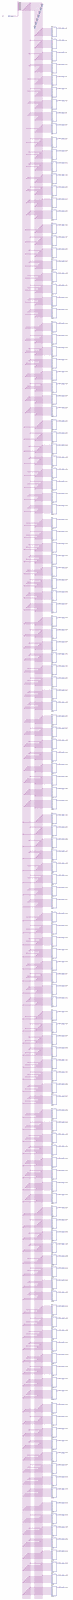
[diagram p0: schematic sheet, whole]
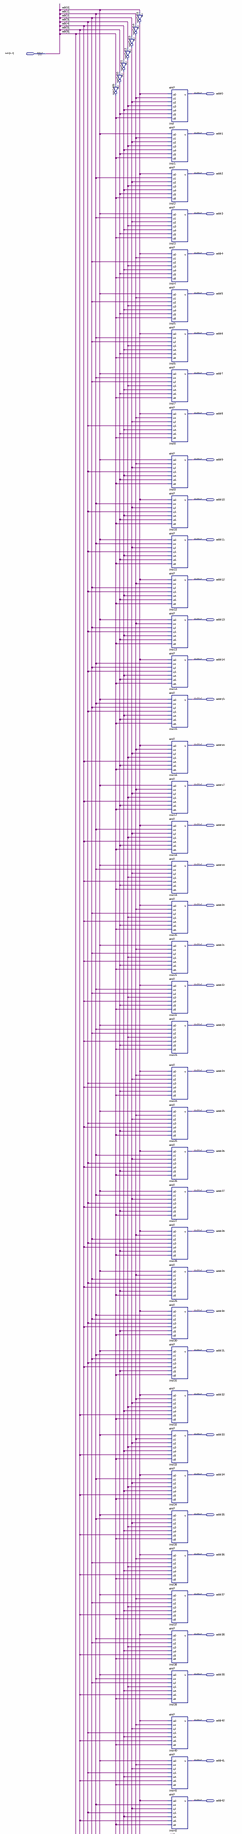
[diagram p1: schematic sheet, upper part]
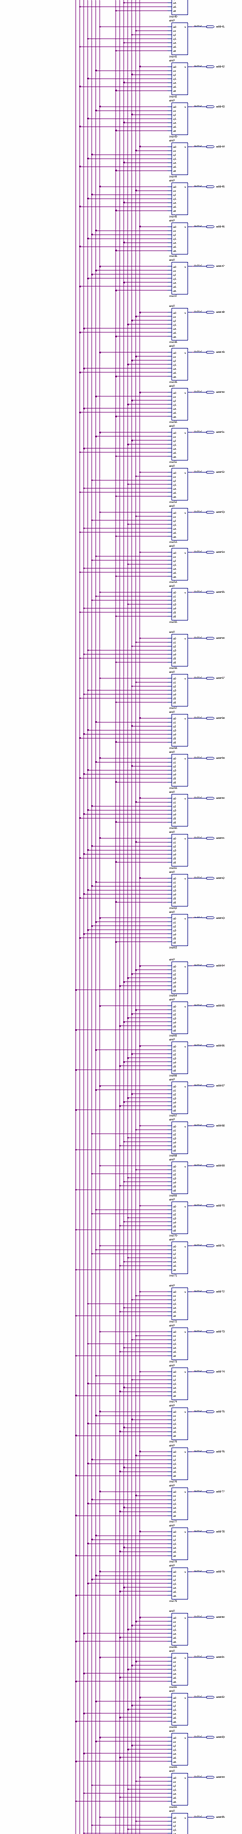
[diagram p2: schematic sheet, middle part]
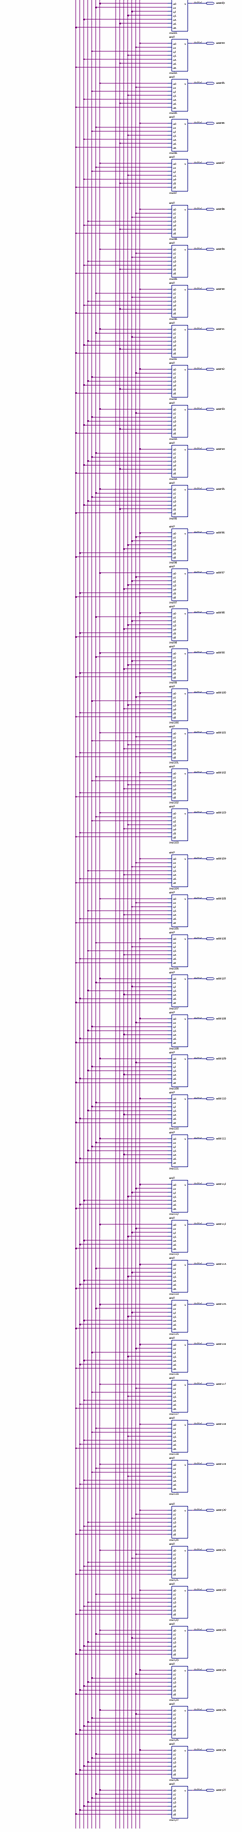
[diagram p3: schematic sheet, lower part]
// Quartus schematic ymq_7.bdf as structural Verilog: 135 symbols, 129 pins
module ymq_7 (
  input  [6:0] adr,
  output addr0,
  output addr1,
  output addr2,
  output addr3,
  output addr4,
  output addr5,
  output addr6,
  output addr7,
  output addr8,
  output addr9,
  output addr10,
  output addr11,
  output addr12,
  output addr13,
  output addr14,
  output addr15,
  output addr16,
  output addr17,
  output addr18,
  output addr19,
  output addr20,
  output addr21,
  output addr22,
  output addr23,
  output addr24,
  output addr25,
  output addr26,
  output addr27,
  output addr28,
  output addr29,
  output addr30,
  output addr31,
  output addr32,
  output addr33,
  output addr34,
  output addr35,
  output addr36,
  output addr37,
  output addr38,
  output addr39,
  output addr40,
  output addr41,
  output addr42,
  output addr43,
  output addr44,
  output addr45,
  output addr46,
  output addr47,
  output addr48,
  output addr49,
  output addr50,
  output addr51,
  output addr52,
  output addr53,
  output addr54,
  output addr55,
  output addr56,
  output addr57,
  output addr58,
  output addr59,
  output addr60,
  output addr61,
  output addr62,
  output addr63,
  output addr64,
  output addr65,
  output addr66,
  output addr67,
  output addr68,
  output addr69,
  output addr70,
  output addr71,
  output addr72,
  output addr73,
  output addr74,
  output addr75,
  output addr76,
  output addr77,
  output addr78,
  output addr79,
  output addr80,
  output addr81,
  output addr82,
  output addr83,
  output addr84,
  output addr85,
  output addr86,
  output addr87,
  output addr88,
  output addr89,
  output addr90,
  output addr91,
  output addr92,
  output addr93,
  output addr94,
  output addr95,
  output addr96,
  output addr97,
  output addr98,
  output addr99,
  output addr100,
  output addr101,
  output addr102,
  output addr103,
  output addr104,
  output addr105,
  output addr106,
  output addr107,
  output addr108,
  output addr109,
  output addr110,
  output addr111,
  output addr112,
  output addr113,
  output addr114,
  output addr115,
  output addr116,
  output addr117,
  output addr118,
  output addr119,
  output addr120,
  output addr121,
  output addr122,
  output addr123,
  output addr124,
  output addr125,
  output addr126,
  output addr127
);

  wire inst1409_out, inst1410_out, inst1411_out, inst1412_out, inst1413_out, inst1414_out, inst1415_out;

  not inst1410 (inst1410_out, adr[5]);
  not inst1409 (inst1409_out, adr[6]);
  not inst1414 (inst1414_out, adr[1]);
  not inst1413 (inst1413_out, adr[2]);
  not inst1412 (inst1412_out, adr[3]);
  not inst1411 (inst1411_out, adr[4]);
  not inst1415 (inst1415_out, adr[0]);
  and7 inst (
    .u0(inst1415_out), .u1(inst1414_out), .u2(inst1413_out), .u3(inst1412_out), .u4(inst1411_out),
    .u5(inst1410_out), .u6(inst1409_out), .v(addr0));
  and7 inst1 (
    .u0(adr[0]), .u1(inst1414_out), .u2(inst1413_out), .u3(inst1412_out), .u4(inst1411_out),
    .u5(inst1410_out), .u6(inst1409_out), .v(addr1));
  and7 inst2 (
    .u0(inst1415_out), .u1(adr[1]), .u2(inst1413_out), .u3(inst1412_out), .u4(inst1411_out),
    .u5(inst1410_out), .u6(inst1409_out), .v(addr2));
  and7 inst3 (
    .u0(adr[0]), .u1(adr[1]), .u2(inst1413_out), .u3(inst1412_out), .u4(inst1411_out), .u5(inst1410_out),
    .u6(inst1409_out), .v(addr3));
  and7 inst4 (
    .u0(inst1415_out), .u1(inst1414_out), .u2(adr[2]), .u3(inst1412_out), .u4(inst1411_out),
    .u5(inst1410_out), .u6(inst1409_out), .v(addr4));
  and7 inst5 (
    .u0(adr[0]), .u1(inst1414_out), .u2(adr[2]), .u3(inst1412_out), .u4(inst1411_out), .u5(inst1410_out),
    .u6(inst1409_out), .v(addr5));
  and7 inst6 (
    .u0(inst1415_out), .u1(adr[1]), .u2(adr[2]), .u3(inst1412_out), .u4(inst1411_out), .u5(inst1410_out),
    .u6(inst1409_out), .v(addr6));
  and7 inst7 (
    .u0(adr[0]), .u1(adr[1]), .u2(adr[2]), .u3(inst1412_out), .u4(inst1411_out), .u5(inst1410_out),
    .u6(inst1409_out), .v(addr7));
  and7 inst8 (
    .u0(inst1415_out), .u1(inst1414_out), .u2(inst1413_out), .u3(adr[3]), .u4(inst1411_out),
    .u5(inst1410_out), .u6(inst1409_out), .v(addr8));
  and7 inst9 (
    .u0(adr[0]), .u1(inst1414_out), .u2(inst1413_out), .u3(adr[3]), .u4(inst1411_out), .u5(inst1410_out),
    .u6(inst1409_out), .v(addr9));
  and7 inst10 (
    .u0(inst1415_out), .u1(adr[1]), .u2(inst1413_out), .u3(adr[3]), .u4(inst1411_out), .u5(inst1410_out),
    .u6(inst1409_out), .v(addr10));
  and7 inst11 (
    .u0(adr[0]), .u1(adr[1]), .u2(inst1413_out), .u3(adr[3]), .u4(inst1411_out), .u5(inst1410_out),
    .u6(inst1409_out), .v(addr11));
  and7 inst12 (
    .u0(inst1415_out), .u1(inst1414_out), .u2(adr[2]), .u3(adr[3]), .u4(inst1411_out), .u5(inst1410_out),
    .u6(inst1409_out), .v(addr12));
  and7 inst13 (
    .u0(adr[0]), .u1(inst1414_out), .u2(adr[2]), .u3(adr[3]), .u4(inst1411_out), .u5(inst1410_out),
    .u6(inst1409_out), .v(addr13));
  and7 inst14 (
    .u0(inst1415_out), .u1(adr[1]), .u2(adr[2]), .u3(adr[3]), .u4(inst1411_out), .u5(inst1410_out),
    .u6(inst1409_out), .v(addr14));
  and7 inst15 (
    .u0(adr[0]), .u1(adr[1]), .u2(adr[2]), .u3(adr[3]), .u4(inst1411_out), .u5(inst1410_out),
    .u6(inst1409_out), .v(addr15));
  and7 inst16 (
    .u0(inst1415_out), .u1(inst1414_out), .u2(inst1413_out), .u3(inst1412_out), .u4(adr[4]),
    .u5(inst1410_out), .u6(inst1409_out), .v(addr16));
  and7 inst17 (
    .u0(adr[0]), .u1(inst1414_out), .u2(inst1413_out), .u3(inst1412_out), .u4(adr[4]), .u5(inst1410_out),
    .u6(inst1409_out), .v(addr17));
  and7 inst18 (
    .u0(inst1415_out), .u1(adr[1]), .u2(inst1413_out), .u3(inst1412_out), .u4(adr[4]), .u5(inst1410_out),
    .u6(inst1409_out), .v(addr18));
  and7 inst19 (
    .u0(adr[0]), .u1(adr[1]), .u2(inst1413_out), .u3(inst1412_out), .u4(adr[4]), .u5(inst1410_out),
    .u6(inst1409_out), .v(addr19));
  and7 inst20 (
    .u0(inst1415_out), .u1(inst1414_out), .u2(adr[2]), .u3(inst1412_out), .u4(adr[4]), .u5(inst1410_out),
    .u6(inst1409_out), .v(addr20));
  and7 inst21 (
    .u0(adr[0]), .u1(inst1414_out), .u2(adr[2]), .u3(inst1412_out), .u4(adr[4]), .u5(inst1410_out),
    .u6(inst1409_out), .v(addr21));
  and7 inst22 (
    .u0(inst1415_out), .u1(adr[1]), .u2(adr[2]), .u3(inst1412_out), .u4(adr[4]), .u5(inst1410_out),
    .u6(inst1409_out), .v(addr22));
  and7 inst23 (
    .u0(adr[0]), .u1(adr[1]), .u2(adr[2]), .u3(inst1412_out), .u4(adr[4]), .u5(inst1410_out),
    .u6(inst1409_out), .v(addr23));
  and7 inst24 (
    .u0(inst1415_out), .u1(inst1414_out), .u2(inst1413_out), .u3(adr[3]), .u4(adr[4]), .u5(inst1410_out),
    .u6(inst1409_out), .v(addr24));
  and7 inst25 (
    .u0(adr[0]), .u1(inst1414_out), .u2(inst1413_out), .u3(adr[3]), .u4(adr[4]), .u5(inst1410_out),
    .u6(inst1409_out), .v(addr25));
  and7 inst26 (
    .u0(inst1415_out), .u1(adr[1]), .u2(inst1413_out), .u3(adr[3]), .u4(adr[4]), .u5(inst1410_out),
    .u6(inst1409_out), .v(addr26));
  and7 inst27 (
    .u0(adr[0]), .u1(adr[1]), .u2(inst1413_out), .u3(adr[3]), .u4(adr[4]), .u5(inst1410_out),
    .u6(inst1409_out), .v(addr27));
  and7 inst28 (
    .u0(inst1415_out), .u1(inst1414_out), .u2(adr[2]), .u3(adr[3]), .u4(adr[4]), .u5(inst1410_out),
    .u6(inst1409_out), .v(addr28));
  and7 inst29 (
    .u0(adr[0]), .u1(inst1414_out), .u2(adr[2]), .u3(adr[3]), .u4(adr[4]), .u5(inst1410_out),
    .u6(inst1409_out), .v(addr29));
  and7 inst30 (
    .u0(inst1415_out), .u1(adr[1]), .u2(adr[2]), .u3(adr[3]), .u4(adr[4]), .u5(inst1410_out),
    .u6(inst1409_out), .v(addr30));
  and7 inst31 (
    .u0(adr[0]), .u1(adr[1]), .u2(adr[2]), .u3(adr[3]), .u4(adr[4]), .u5(inst1410_out), .u6(inst1409_out),
    .v(addr31));
  and7 inst32 (
    .u0(inst1415_out), .u1(inst1414_out), .u2(inst1413_out), .u3(inst1412_out), .u4(inst1411_out),
    .u5(adr[5]), .u6(inst1409_out), .v(addr32));
  and7 inst33 (
    .u0(adr[0]), .u1(inst1414_out), .u2(inst1413_out), .u3(inst1412_out), .u4(inst1411_out), .u5(adr[5]),
    .u6(inst1409_out), .v(addr33));
  and7 inst34 (
    .u0(inst1415_out), .u1(adr[1]), .u2(inst1413_out), .u3(inst1412_out), .u4(inst1411_out), .u5(adr[5]),
    .u6(inst1409_out), .v(addr34));
  and7 inst35 (
    .u0(adr[0]), .u1(adr[1]), .u2(inst1413_out), .u3(inst1412_out), .u4(inst1411_out), .u5(adr[5]),
    .u6(inst1409_out), .v(addr35));
  and7 inst36 (
    .u0(inst1415_out), .u1(inst1414_out), .u2(adr[2]), .u3(inst1412_out), .u4(inst1411_out), .u5(adr[5]),
    .u6(inst1409_out), .v(addr36));
  and7 inst37 (
    .u0(adr[0]), .u1(inst1414_out), .u2(adr[2]), .u3(inst1412_out), .u4(inst1411_out), .u5(adr[5]),
    .u6(inst1409_out), .v(addr37));
  and7 inst38 (
    .u0(inst1415_out), .u1(adr[1]), .u2(adr[2]), .u3(inst1412_out), .u4(inst1411_out), .u5(adr[5]),
    .u6(inst1409_out), .v(addr38));
  and7 inst39 (
    .u0(adr[0]), .u1(adr[1]), .u2(adr[2]), .u3(inst1412_out), .u4(inst1411_out), .u5(adr[5]),
    .u6(inst1409_out), .v(addr39));
  and7 inst40 (
    .u0(inst1415_out), .u1(inst1414_out), .u2(inst1413_out), .u3(adr[3]), .u4(inst1411_out), .u5(adr[5]),
    .u6(inst1409_out), .v(addr40));
  and7 inst41 (
    .u0(adr[0]), .u1(inst1414_out), .u2(inst1413_out), .u3(adr[3]), .u4(inst1411_out), .u5(adr[5]),
    .u6(inst1409_out), .v(addr41));
  and7 inst42 (
    .u0(inst1415_out), .u1(adr[1]), .u2(inst1413_out), .u3(adr[3]), .u4(inst1411_out), .u5(adr[5]),
    .u6(inst1409_out), .v(addr42));
  and7 inst43 (
    .u0(adr[0]), .u1(adr[1]), .u2(inst1413_out), .u3(adr[3]), .u4(inst1411_out), .u5(adr[5]),
    .u6(inst1409_out), .v(addr43));
  and7 inst44 (
    .u0(inst1415_out), .u1(inst1414_out), .u2(adr[2]), .u3(adr[3]), .u4(inst1411_out), .u5(adr[5]),
    .u6(inst1409_out), .v(addr44));
  and7 inst45 (
    .u0(adr[0]), .u1(inst1414_out), .u2(adr[2]), .u3(adr[3]), .u4(inst1411_out), .u5(adr[5]),
    .u6(inst1409_out), .v(addr45));
  and7 inst46 (
    .u0(inst1415_out), .u1(adr[1]), .u2(adr[2]), .u3(adr[3]), .u4(inst1411_out), .u5(adr[5]),
    .u6(inst1409_out), .v(addr46));
  and7 inst47 (
    .u0(adr[0]), .u1(adr[1]), .u2(adr[2]), .u3(adr[3]), .u4(inst1411_out), .u5(adr[5]), .u6(inst1409_out),
    .v(addr47));
  and7 inst48 (
    .u0(inst1415_out), .u1(inst1414_out), .u2(inst1413_out), .u3(inst1412_out), .u4(adr[4]), .u5(adr[5]),
    .u6(inst1409_out), .v(addr48));
  and7 inst49 (
    .u0(adr[0]), .u1(inst1414_out), .u2(inst1413_out), .u3(inst1412_out), .u4(adr[4]), .u5(adr[5]),
    .u6(inst1409_out), .v(addr49));
  and7 inst50 (
    .u0(inst1415_out), .u1(adr[1]), .u2(inst1413_out), .u3(inst1412_out), .u4(adr[4]), .u5(adr[5]),
    .u6(inst1409_out), .v(addr50));
  and7 inst51 (
    .u0(adr[0]), .u1(adr[1]), .u2(inst1413_out), .u3(inst1412_out), .u4(adr[4]), .u5(adr[5]),
    .u6(inst1409_out), .v(addr51));
  and7 inst52 (
    .u0(inst1415_out), .u1(inst1414_out), .u2(adr[2]), .u3(inst1412_out), .u4(adr[4]), .u5(adr[5]),
    .u6(inst1409_out), .v(addr52));
  and7 inst53 (
    .u0(adr[0]), .u1(inst1414_out), .u2(adr[2]), .u3(inst1412_out), .u4(adr[4]), .u5(adr[5]),
    .u6(inst1409_out), .v(addr53));
  and7 inst54 (
    .u0(inst1415_out), .u1(adr[1]), .u2(adr[2]), .u3(inst1412_out), .u4(adr[4]), .u5(adr[5]),
    .u6(inst1409_out), .v(addr54));
  and7 inst55 (
    .u0(adr[0]), .u1(adr[1]), .u2(adr[2]), .u3(inst1412_out), .u4(adr[4]), .u5(adr[5]), .u6(inst1409_out),
    .v(addr55));
  and7 inst56 (
    .u0(inst1415_out), .u1(inst1414_out), .u2(inst1413_out), .u3(adr[3]), .u4(adr[4]), .u5(adr[5]),
    .u6(inst1409_out), .v(addr56));
  and7 inst57 (
    .u0(adr[0]), .u1(inst1414_out), .u2(inst1413_out), .u3(adr[3]), .u4(adr[4]), .u5(adr[5]),
    .u6(inst1409_out), .v(addr57));
  and7 inst58 (
    .u0(inst1415_out), .u1(adr[1]), .u2(inst1413_out), .u3(adr[3]), .u4(adr[4]), .u5(adr[5]),
    .u6(inst1409_out), .v(addr58));
  and7 inst59 (
    .u0(adr[0]), .u1(adr[1]), .u2(inst1413_out), .u3(adr[3]), .u4(adr[4]), .u5(adr[5]), .u6(inst1409_out),
    .v(addr59));
  and7 inst60 (
    .u0(inst1415_out), .u1(inst1414_out), .u2(adr[2]), .u3(adr[3]), .u4(adr[4]), .u5(adr[5]),
    .u6(inst1409_out), .v(addr60));
  and7 inst61 (
    .u0(adr[0]), .u1(inst1414_out), .u2(adr[2]), .u3(adr[3]), .u4(adr[4]), .u5(adr[5]), .u6(inst1409_out),
    .v(addr61));
  and7 inst62 (
    .u0(inst1415_out), .u1(adr[1]), .u2(adr[2]), .u3(adr[3]), .u4(adr[4]), .u5(adr[5]), .u6(inst1409_out),
    .v(addr62));
  and7 inst63 (
    .u0(adr[0]), .u1(adr[1]), .u2(adr[2]), .u3(adr[3]), .u4(adr[4]), .u5(adr[5]), .u6(inst1409_out),
    .v(addr63));
  and7 inst64 (
    .u0(inst1415_out), .u1(inst1414_out), .u2(inst1413_out), .u3(inst1412_out), .u4(inst1411_out),
    .u5(inst1410_out), .u6(adr[6]), .v(addr64));
  and7 inst65 (
    .u0(adr[0]), .u1(inst1414_out), .u2(inst1413_out), .u3(inst1412_out), .u4(inst1411_out),
    .u5(inst1410_out), .u6(adr[6]), .v(addr65));
  and7 inst66 (
    .u0(inst1415_out), .u1(adr[1]), .u2(inst1413_out), .u3(inst1412_out), .u4(inst1411_out),
    .u5(inst1410_out), .u6(adr[6]), .v(addr66));
  and7 inst67 (
    .u0(adr[0]), .u1(adr[1]), .u2(inst1413_out), .u3(inst1412_out), .u4(inst1411_out), .u5(inst1410_out),
    .u6(adr[6]), .v(addr67));
  and7 inst68 (
    .u0(inst1415_out), .u1(inst1414_out), .u2(adr[2]), .u3(inst1412_out), .u4(inst1411_out),
    .u5(inst1410_out), .u6(adr[6]), .v(addr68));
  and7 inst69 (
    .u0(adr[0]), .u1(inst1414_out), .u2(adr[2]), .u3(inst1412_out), .u4(inst1411_out), .u5(inst1410_out),
    .u6(adr[6]), .v(addr69));
  and7 inst70 (
    .u0(inst1415_out), .u1(adr[1]), .u2(adr[2]), .u3(inst1412_out), .u4(inst1411_out), .u5(inst1410_out),
    .u6(adr[6]), .v(addr70));
  and7 inst71 (
    .u0(adr[0]), .u1(adr[1]), .u2(adr[2]), .u3(inst1412_out), .u4(inst1411_out), .u5(inst1410_out),
    .u6(adr[6]), .v(addr71));
  and7 inst72 (
    .u0(inst1415_out), .u1(inst1414_out), .u2(inst1413_out), .u3(adr[3]), .u4(inst1411_out),
    .u5(inst1410_out), .u6(adr[6]), .v(addr72));
  and7 inst73 (
    .u0(adr[0]), .u1(inst1414_out), .u2(inst1413_out), .u3(adr[3]), .u4(inst1411_out), .u5(inst1410_out),
    .u6(adr[6]), .v(addr73));
  and7 inst74 (
    .u0(inst1415_out), .u1(adr[1]), .u2(inst1413_out), .u3(adr[3]), .u4(inst1411_out), .u5(inst1410_out),
    .u6(adr[6]), .v(addr74));
  and7 inst75 (
    .u0(adr[0]), .u1(adr[1]), .u2(inst1413_out), .u3(adr[3]), .u4(inst1411_out), .u5(inst1410_out),
    .u6(adr[6]), .v(addr75));
  and7 inst76 (
    .u0(inst1415_out), .u1(inst1414_out), .u2(adr[2]), .u3(adr[3]), .u4(inst1411_out), .u5(inst1410_out),
    .u6(adr[6]), .v(addr76));
  and7 inst77 (
    .u0(adr[0]), .u1(inst1414_out), .u2(adr[2]), .u3(adr[3]), .u4(inst1411_out), .u5(inst1410_out),
    .u6(adr[6]), .v(addr77));
  and7 inst78 (
    .u0(inst1415_out), .u1(adr[1]), .u2(adr[2]), .u3(adr[3]), .u4(inst1411_out), .u5(inst1410_out),
    .u6(adr[6]), .v(addr78));
  and7 inst79 (
    .u0(adr[0]), .u1(adr[1]), .u2(adr[2]), .u3(adr[3]), .u4(inst1411_out), .u5(inst1410_out), .u6(adr[6]),
    .v(addr79));
  and7 inst80 (
    .u0(inst1415_out), .u1(inst1414_out), .u2(inst1413_out), .u3(inst1412_out), .u4(adr[4]),
    .u5(inst1410_out), .u6(adr[6]), .v(addr80));
  and7 inst81 (
    .u0(adr[0]), .u1(inst1414_out), .u2(inst1413_out), .u3(inst1412_out), .u4(adr[4]), .u5(inst1410_out),
    .u6(adr[6]), .v(addr81));
  and7 inst82 (
    .u0(inst1415_out), .u1(adr[1]), .u2(inst1413_out), .u3(inst1412_out), .u4(adr[4]), .u5(inst1410_out),
    .u6(adr[6]), .v(addr82));
  and7 inst83 (
    .u0(adr[0]), .u1(adr[1]), .u2(inst1413_out), .u3(inst1412_out), .u4(adr[4]), .u5(inst1410_out),
    .u6(adr[6]), .v(addr83));
  and7 inst84 (
    .u0(inst1415_out), .u1(inst1414_out), .u2(adr[2]), .u3(inst1412_out), .u4(adr[4]), .u5(inst1410_out),
    .u6(adr[6]), .v(addr84));
  and7 inst85 (
    .u0(adr[0]), .u1(inst1414_out), .u2(adr[2]), .u3(inst1412_out), .u4(adr[4]), .u5(inst1410_out),
    .u6(adr[6]), .v(addr85));
  and7 inst86 (
    .u0(inst1415_out), .u1(adr[1]), .u2(adr[2]), .u3(inst1412_out), .u4(adr[4]), .u5(inst1410_out),
    .u6(adr[6]), .v(addr86));
  and7 inst87 (
    .u0(adr[0]), .u1(adr[1]), .u2(adr[2]), .u3(inst1412_out), .u4(adr[4]), .u5(inst1410_out), .u6(adr[6]),
    .v(addr87));
  and7 inst88 (
    .u0(inst1415_out), .u1(inst1414_out), .u2(inst1413_out), .u3(adr[3]), .u4(adr[4]), .u5(inst1410_out),
    .u6(adr[6]), .v(addr88));
  and7 inst89 (
    .u0(adr[0]), .u1(inst1414_out), .u2(inst1413_out), .u3(adr[3]), .u4(adr[4]), .u5(inst1410_out),
    .u6(adr[6]), .v(addr89));
  and7 inst90 (
    .u0(inst1415_out), .u1(adr[1]), .u2(inst1413_out), .u3(adr[3]), .u4(adr[4]), .u5(inst1410_out),
    .u6(adr[6]), .v(addr90));
  and7 inst91 (
    .u0(adr[0]), .u1(adr[1]), .u2(inst1413_out), .u3(adr[3]), .u4(adr[4]), .u5(inst1410_out), .u6(adr[6]),
    .v(addr91));
  and7 inst92 (
    .u0(inst1415_out), .u1(inst1414_out), .u2(adr[2]), .u3(adr[3]), .u4(adr[4]), .u5(inst1410_out),
    .u6(adr[6]), .v(addr92));
  and7 inst93 (
    .u0(adr[0]), .u1(inst1414_out), .u2(adr[2]), .u3(adr[3]), .u4(adr[4]), .u5(inst1410_out), .u6(adr[6]),
    .v(addr93));
  and7 inst94 (
    .u0(inst1415_out), .u1(adr[1]), .u2(adr[2]), .u3(adr[3]), .u4(adr[4]), .u5(inst1410_out), .u6(adr[6]),
    .v(addr94));
  and7 inst95 (
    .u0(adr[0]), .u1(adr[1]), .u2(adr[2]), .u3(adr[3]), .u4(adr[4]), .u5(inst1410_out), .u6(adr[6]),
    .v(addr95));
  and7 inst96 (
    .u0(inst1415_out), .u1(inst1414_out), .u2(inst1413_out), .u3(inst1412_out), .u4(inst1411_out),
    .u5(adr[5]), .u6(adr[6]), .v(addr96));
  and7 inst97 (
    .u0(adr[0]), .u1(inst1414_out), .u2(inst1413_out), .u3(inst1412_out), .u4(inst1411_out), .u5(adr[5]),
    .u6(adr[6]), .v(addr97));
  and7 inst98 (
    .u0(inst1415_out), .u1(adr[1]), .u2(inst1413_out), .u3(inst1412_out), .u4(inst1411_out), .u5(adr[5]),
    .u6(adr[6]), .v(addr98));
  and7 inst99 (
    .u0(adr[0]), .u1(adr[1]), .u2(inst1413_out), .u3(inst1412_out), .u4(inst1411_out), .u5(adr[5]),
    .u6(adr[6]), .v(addr99));
  and7 inst100 (
    .u0(inst1415_out), .u1(inst1414_out), .u2(adr[2]), .u3(inst1412_out), .u4(inst1411_out), .u5(adr[5]),
    .u6(adr[6]), .v(addr100));
  and7 inst101 (
    .u0(adr[0]), .u1(inst1414_out), .u2(adr[2]), .u3(inst1412_out), .u4(inst1411_out), .u5(adr[5]),
    .u6(adr[6]), .v(addr101));
  and7 inst102 (
    .u0(inst1415_out), .u1(adr[1]), .u2(adr[2]), .u3(inst1412_out), .u4(inst1411_out), .u5(adr[5]),
    .u6(adr[6]), .v(addr102));
  and7 inst103 (
    .u0(adr[0]), .u1(adr[1]), .u2(adr[2]), .u3(inst1412_out), .u4(inst1411_out), .u5(adr[5]), .u6(adr[6]),
    .v(addr103));
  and7 inst104 (
    .u0(inst1415_out), .u1(inst1414_out), .u2(inst1413_out), .u3(adr[3]), .u4(inst1411_out), .u5(adr[5]),
    .u6(adr[6]), .v(addr104));
  and7 inst105 (
    .u0(adr[0]), .u1(inst1414_out), .u2(inst1413_out), .u3(adr[3]), .u4(inst1411_out), .u5(adr[5]),
    .u6(adr[6]), .v(addr105));
  and7 inst106 (
    .u0(inst1415_out), .u1(adr[1]), .u2(inst1413_out), .u3(adr[3]), .u4(inst1411_out), .u5(adr[5]),
    .u6(adr[6]), .v(addr106));
  and7 inst107 (
    .u0(adr[0]), .u1(adr[1]), .u2(inst1413_out), .u3(adr[3]), .u4(inst1411_out), .u5(adr[5]), .u6(adr[6]),
    .v(addr107));
  and7 inst108 (
    .u0(inst1415_out), .u1(inst1414_out), .u2(adr[2]), .u3(adr[3]), .u4(inst1411_out), .u5(adr[5]),
    .u6(adr[6]), .v(addr108));
  and7 inst109 (
    .u0(adr[0]), .u1(inst1414_out), .u2(adr[2]), .u3(adr[3]), .u4(inst1411_out), .u5(adr[5]), .u6(adr[6]),
    .v(addr109));
  and7 inst110 (
    .u0(inst1415_out), .u1(adr[1]), .u2(adr[2]), .u3(adr[3]), .u4(inst1411_out), .u5(adr[5]), .u6(adr[6]),
    .v(addr110));
  and7 inst111 (
    .u0(adr[0]), .u1(adr[1]), .u2(adr[2]), .u3(adr[3]), .u4(inst1411_out), .u5(adr[5]), .u6(adr[6]),
    .v(addr111));
  and7 inst112 (
    .u0(inst1415_out), .u1(inst1414_out), .u2(inst1413_out), .u3(inst1412_out), .u4(adr[4]), .u5(adr[5]),
    .u6(adr[6]), .v(addr112));
  and7 inst113 (
    .u0(adr[0]), .u1(inst1414_out), .u2(inst1413_out), .u3(inst1412_out), .u4(adr[4]), .u5(adr[5]),
    .u6(adr[6]), .v(addr113));
  and7 inst114 (
    .u0(inst1415_out), .u1(adr[1]), .u2(inst1413_out), .u3(inst1412_out), .u4(adr[4]), .u5(adr[5]),
    .u6(adr[6]), .v(addr114));
  and7 inst115 (
    .u0(adr[0]), .u1(adr[1]), .u2(inst1413_out), .u3(inst1412_out), .u4(adr[4]), .u5(adr[5]), .u6(adr[6]),
    .v(addr115));
  and7 inst116 (
    .u0(inst1415_out), .u1(inst1414_out), .u2(adr[2]), .u3(inst1412_out), .u4(adr[4]), .u5(adr[5]),
    .u6(adr[6]), .v(addr116));
  and7 inst117 (
    .u0(adr[0]), .u1(inst1414_out), .u2(adr[2]), .u3(inst1412_out), .u4(adr[4]), .u5(adr[5]), .u6(adr[6]),
    .v(addr117));
  and7 inst118 (
    .u0(inst1415_out), .u1(adr[1]), .u2(adr[2]), .u3(inst1412_out), .u4(adr[4]), .u5(adr[5]), .u6(adr[6]),
    .v(addr118));
  and7 inst119 (
    .u0(adr[0]), .u1(adr[1]), .u2(adr[2]), .u3(inst1412_out), .u4(adr[4]), .u5(adr[5]), .u6(adr[6]),
    .v(addr119));
  and7 inst120 (
    .u0(inst1415_out), .u1(inst1414_out), .u2(inst1413_out), .u3(adr[3]), .u4(adr[4]), .u5(adr[5]),
    .u6(adr[6]), .v(addr120));
  and7 inst121 (
    .u0(adr[0]), .u1(inst1414_out), .u2(inst1413_out), .u3(adr[3]), .u4(adr[4]), .u5(adr[5]), .u6(adr[6]),
    .v(addr121));
  and7 inst122 (
    .u0(inst1415_out), .u1(adr[1]), .u2(inst1413_out), .u3(adr[3]), .u4(adr[4]), .u5(adr[5]), .u6(adr[6]),
    .v(addr122));
  and7 inst123 (
    .u0(adr[0]), .u1(adr[1]), .u2(inst1413_out), .u3(adr[3]), .u4(adr[4]), .u5(adr[5]), .u6(adr[6]),
    .v(addr123));
  and7 inst124 (
    .u0(inst1415_out), .u1(inst1414_out), .u2(adr[2]), .u3(adr[3]), .u4(adr[4]), .u5(adr[5]), .u6(adr[6]),
    .v(addr124));
  and7 inst125 (
    .u0(adr[0]), .u1(inst1414_out), .u2(adr[2]), .u3(adr[3]), .u4(adr[4]), .u5(adr[5]), .u6(adr[6]),
    .v(addr125));
  and7 inst126 (
    .u0(inst1415_out), .u1(adr[1]), .u2(adr[2]), .u3(adr[3]), .u4(adr[4]), .u5(adr[5]), .u6(adr[6]),
    .v(addr126));
  and7 inst127 (.u0(adr[0]), .u1(adr[1]), .u2(adr[2]), .u3(adr[3]), .u4(adr[4]), .u5(adr[5]), .u6(adr[6]), .v(addr127));
endmodule
